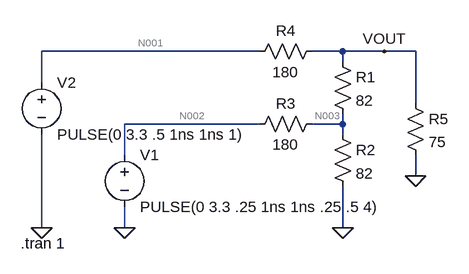
[diagram p0: schematic DAC_Sim_R_2R.asc]
DAC_Sim_R_2R.asc, the LTspice schematic file:
Version 4
SHEET 1 880 680
WIRE -64 -32 -400 -32
WIRE 64 -32 16 -32
WIRE 128 -32 64 -32
WIRE 176 -32 128 -32
WIRE 64 -16 64 -32
WIRE -400 16 -400 -32
WIRE 176 48 176 -32
WIRE -64 80 -272 80
WIRE 64 80 64 64
WIRE 64 80 16 80
WIRE 64 96 64 80
WIRE -272 128 -272 80
WIRE 176 160 176 128
WIRE -400 240 -400 96
WIRE -272 240 -272 208
WIRE 64 240 64 176
FLAG -272 240 0
FLAG -400 240 0
FLAG 176 160 0
FLAG 128 -32 VOUT
FLAG 64 240 0
SYMBOL res 32 64 R90
WINDOW 0 0 56 VBottom 2
WINDOW 3 32 56 VTop 2
SYMATTR InstName R3
SYMATTR Value 180
SYMBOL res 32 -48 R90
WINDOW 0 0 56 VBottom 2
WINDOW 3 32 56 VTop 2
SYMATTR InstName R4
SYMATTR Value 180
SYMBOL voltage -272 112 R0
WINDOW 123 0 0 Left 0
WINDOW 39 0 0 Left 0
SYMATTR InstName V1
SYMATTR Value PULSE(0 3.3 .25 1ns 1ns .25 .5 4)
SYMBOL voltage -400 0 R0
WINDOW 123 0 0 Left 0
WINDOW 39 0 0 Left 0
SYMATTR InstName V2
SYMATTR Value PULSE(0 3.3 .5 1ns 1ns 1)
SYMBOL res 160 32 R0
SYMATTR InstName R5
SYMATTR Value 75
SYMBOL res 48 -32 R0
SYMATTR InstName R1
SYMATTR Value 82
SYMBOL res 48 80 R0
SYMATTR InstName R2
SYMATTR Value 82
TEXT -432 264 Left 2 !.tran 1

The netlist it stands for:
* DAC_Sim_R_2R.asc
R3 N003 N002 180
R4 VOUT N001 180
V1 N002 0 PULSE(0 3.3 .25 1ns 1ns .25 .5 4)
V2 N001 0 PULSE(0 3.3 .5 1ns 1ns 1)
R5 VOUT 0 75
R1 VOUT N003 82
R2 N003 0 82
.tran 1
.backanno
.end

* Results of the author's LTspice run, read from the files saved beside the schematic
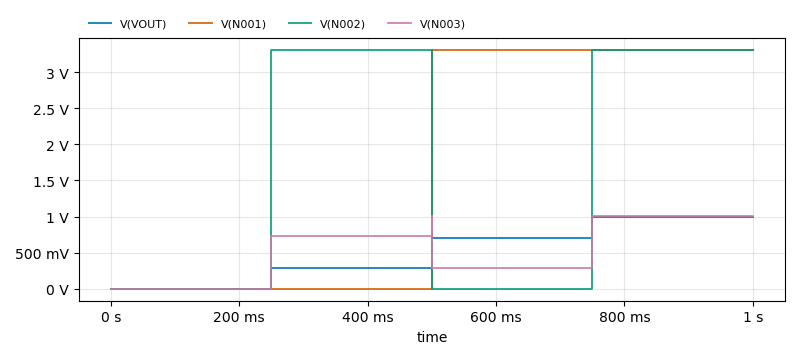
[diagram p1: Transient Analysis of DAC_Sim_R_2R.asc, plotted from the saved traces]
* Transient Analysis, 1 run:
*   V(VOUT): min 0 V, max 987.8 mV, average 493.9 mV, rms 622.5 mV, last 987.8 mV
*   V(N001): min 0 V, max 3.3 V, average 1.65 V, rms 2.333 V, last 3.3 V
*   V(N002): min 0 V, max 3.3 V, average 1.65 V, rms 2.333 V, last 3.3 V
*   V(N003): min 0 V, max 1.014 V, average 507.2 mV, rms 640.7 mV, last 1.014 V